# Altium project preamplifier.PrjPcb
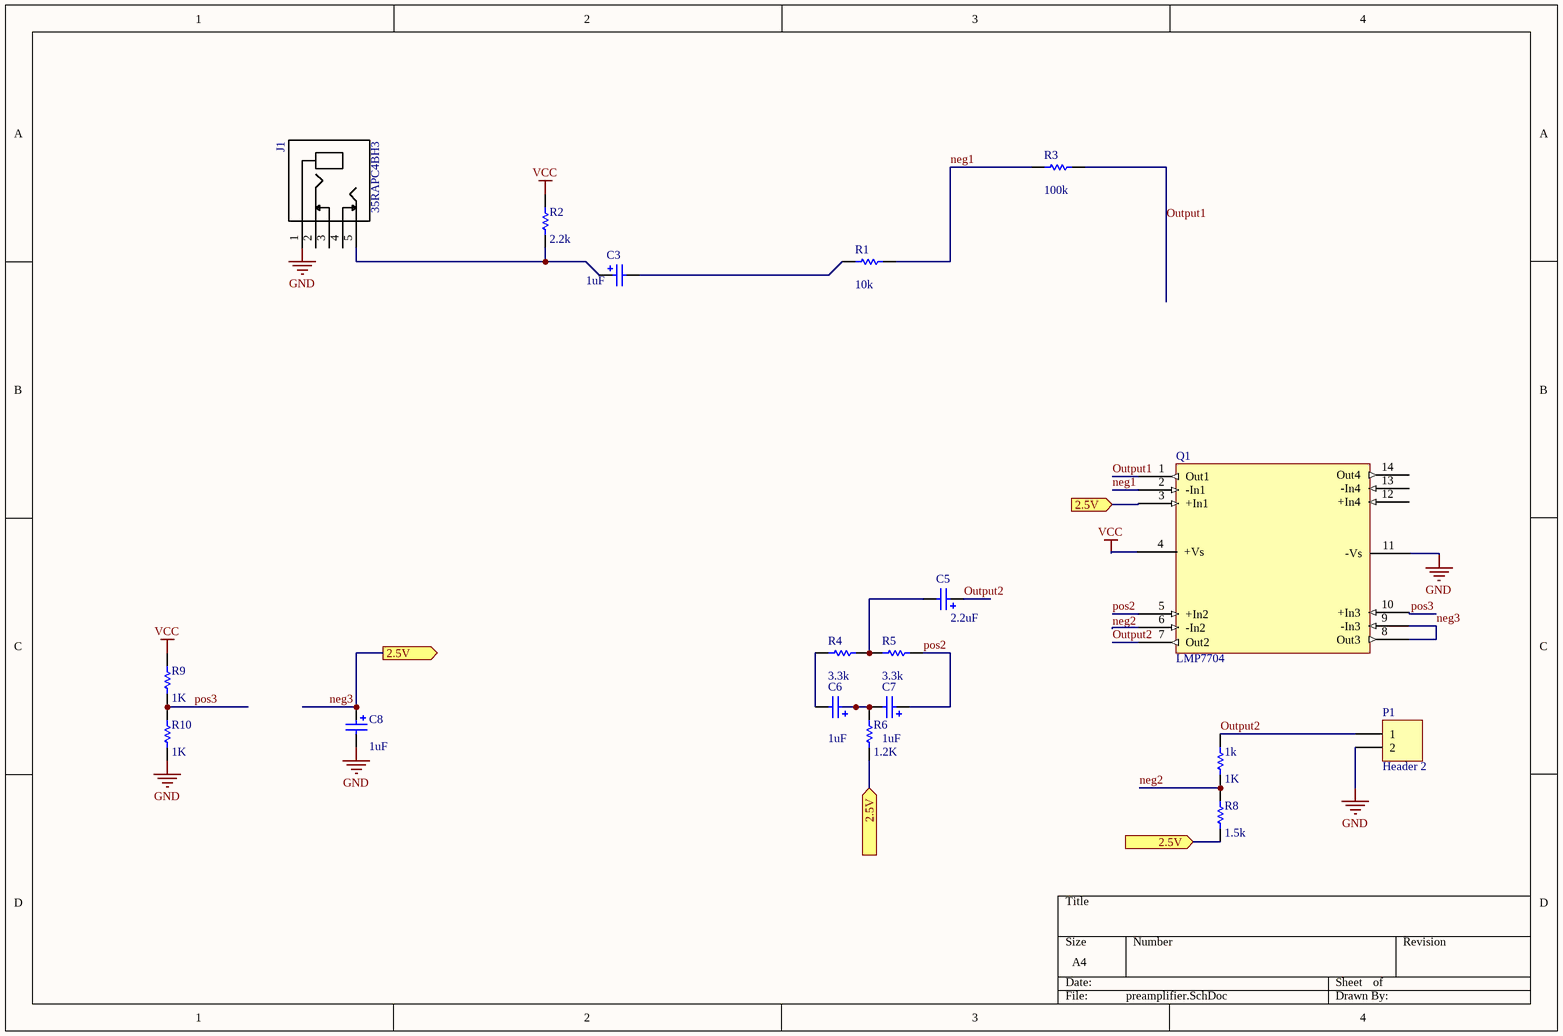
[diagram p0: preamplifier.SchDoc]
2 sheets, 23 parts. Net scope: flat (ports and power ports of the same name join across sheets).
Board file: preamp_pcb.PcbDoc
Sheets:
  preamplifier.SchDoc
  Power.SchDoc

## Sheet preamplifier.SchDoc
size A4

### Parts
1k  value 1K  [AXIAL-0.3]
C3  value 1uF  [Capacitor 5mmx11mm]
C5  value 2.2uF  [Capacitor 5mmx11mm]
C6  value 1uF  [Capacitor 5mmx11mm]
C7  value 1uF  [Capacitor 5mmx11mm]
C8  value 1uF  [Capacitor 5mmx11mm]
J1  35RAPC4BH3  [*SWITCHCRAFT_35RAPC4BH3]
P1  Header 2  [HDR1X2]
Q1  LMP7704  [SOIC-14_BREAKOUT]
R1  value 10k  [AXIAL-0.3]
R2  value 2.2k  [AXIAL-0.3]
R3  value 100k  [AXIAL-0.3]
R4  value 3.3k  [AXIAL-0.3]
R5  value 3.3k  [AXIAL-0.3]
R6  value 1.2K  [AXIAL-0.3]
R8  value 1.5k  [AXIAL-0.3]
R9  value 1K  [AXIAL-0.3]
R10  value 1K  [AXIAL-0.3]

### Ports
2.5V (in), 2.5V (out)

### Nets
GND: C8.2 J1.1 P1.2 Q1.11(-Vs) R10.1
VCC: Q1.4(+Vs) R2.2 R9.2
neg1: Q1.2(-In1) R1.2 R3.1
neg2: 1k.1 Q1.6(-In2) R8.1
neg3: C8.1 Q1.3(+In1) Q1.8(Out3) Q1.9(-In3) R6.1 R8.2 ; port 2.5V
Output1: Q1.1(Out1) R3.2
Output2: 1k.2 C5.1 P1.1 Q1.7(Out2)
pos2: C7.1 Q1.5(+In2) R5.2
pos3: Q1.10(+In3) R9.1 R10.2
NetC3_1: C3.1 J1.5 R2.1
NetC3_2: C3.2 R1.1
NetC5_2: C5.2 R4.2 R5.1
NetC6_1: C6.1 C7.2 R6.2
NetC6_2: C6.2 R4.1

Not connected (* = marked no-connect by the designer): J1 2 3 4; Q1 12(+In4) 13(-In4) 14(Out4)

### Library data of the parts
1k R1-R6 R8-R10 = Res1: Resistor; Published: 8-Jun-2000; LatestRevisionDate: 17-Jul-2002; LatestRevisionNote: Re-released for DXP Platform.; PackageReference: AXIAL-0.3; Publisher: Altium Limited; PackageDescription: Axial Device, Thru-Hole; 2 Leads; 0.3 in Pin Spacing
C3 C5-C8 = Cap Pol1: Polarized Capacitor (Radial); Published: 8-Jun-2000; LatestRevisionDate: 17-Jul-2002; LatestRevisionNote: Re-released for DXP Platform.; PackageReference: RB7.6-15; Publisher: Altium Limited; PackageDescription: Polarized Capacitor (Radial); 2 Leads
J1 = 35RAPC4BH3: 3.50mm _0.141, 1/8, Mini Plug_ - Headphone Phone Jack Stereo _3 Conductor, TRS_ Connector Solder; MF: Switchcraft Inc.; SnapEDA_Link: https://www.snapeda.com/parts/35RAPC4BH3/Switchcraft%20Inc./view-part/621325/?ref=snap; Availability: Unavailable; Package: None; MP: 35RAPC4BH3; Price: None; Value: *
P1 = Header 2: Header, 2-Pin; LatestRevisionDate: 17-Jul-2002; LatestRevisionNote: Re-released for DXP Platform.; Publisher: Altium Limited

## Sheet Power.SchDoc
size A4
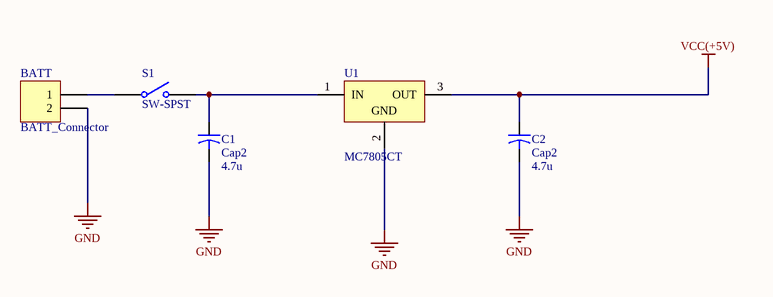
[diagram p1: Power.SchDoc]

### Parts
BATT  BATT_Connector  [HDR1X2]
C1  Cap2  value 4.7u  [Capacitor 5mmx11mm]
C2  Cap2  value 4.7u  [Capacitor 5mmx11mm]
S1  SW-SPST  [SPST-2]
U1  MC7805CT  [221A-06]

### Nets
GND: BATT.2 C1.2 C2.2 U1.2(GND)
VCC(+5V): C2.1 U1.3(OUT)
NetBATT_1: BATT.1 S1.1(COMMON)
NetC1_1: C1.1 S1.2(NO) U1.1(IN)

### Library data of the parts
BATT = Header 2: Header, 2-Pin; LatestRevisionDate: 17-Jul-2002; LatestRevisionNote: Re-released for DXP Platform.; Publisher: Altium Limited
C1 C2 = Cap2: Capacitor; Published: 23-Sep-2002; PackageReference: CAPR5-4X5; Publisher: Altium Limited; PackageDescription: Capacitor; 2 Leads
S1 = SW-SPST: Single-Pole, Single-Throw Switch; Published: 24-Mar-1999; LatestRevisionDate: 17-Jul-2002; LatestRevisionNote: Re-released for DXP Platform.; PackageReference: SPST-2; Publisher: Altium Limited; PackageDescription: Switch; 2 Leads
U1 = MC7805CT: Three-Terminal Positive Voltage Regulator; Note: Heatsink surface is connected to Pin 2; Published: 15-Apr-2002; DatasheetVersion: 1997; PackageVersion: 1997; PackageReference: 221A-06; Publisher: Altium Limited; PackageDescription: TO, Thru-Hole, Vertical, Heatsink Mounted; 3 In-Line Leads; Pitch 2.54 mm; Code_JEDEC: TO-262-AA; ComponentLink1Description: Manufacturer Link; ComponentLink1URL: http://www.onsemi.com/site/products/taxonomy/0,4438,503,00.html; ComponentLink2Description: Datasheet; ComponentLink2URL: http://www.onsemi.com/pub/Collateral/MC7800-D.PDF

## Nets that join several sheets
GND: preamplifier (5 pins), Power (BATT.2 C1.2 C2.2 U1.2)